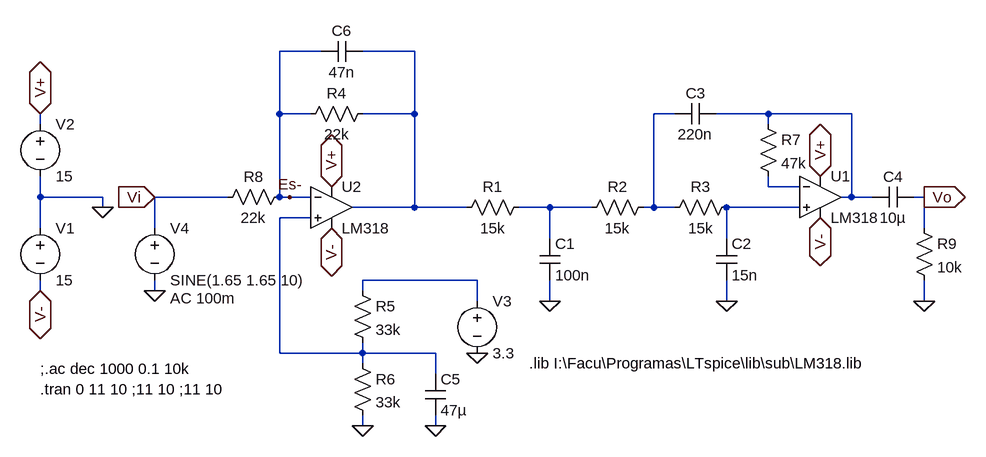
[diagram p0: schematic Filtro Reconstructor Bias.asc]
Filtro Reconstructor Bias.asc, the LTspice schematic file:
Version 4
SHEET 1 1100 680
WIRE -208 -240 -272 -240
WIRE -64 -240 -144 -240
WIRE -272 -144 -272 -240
WIRE -224 -144 -272 -144
WIRE -64 -144 -64 -240
WIRE -64 -144 -144 -144
WIRE 336 -144 304 -144
WIRE 480 -144 400 -144
WIRE 608 -144 480 -144
WIRE -640 -128 -640 -144
WIRE 480 -128 480 -144
WIRE 480 -32 480 -48
WIRE 528 -32 480 -32
WIRE -640 -16 -640 -48
WIRE -544 -16 -640 -16
WIRE -352 -16 -464 -16
WIRE -272 -16 -272 -144
WIRE -256 -16 -272 -16
WIRE -224 -16 -256 -16
WIRE 608 -16 608 -144
WIRE 608 -16 592 -16
WIRE 640 -16 608 -16
WIRE 720 -16 704 -16
WIRE -544 0 -544 -16
WIRE -64 0 -64 -144
WIRE -64 0 -160 0
WIRE 16 0 -64 0
WIRE 144 0 96 0
WIRE 208 0 144 0
WIRE 304 0 304 -144
WIRE 304 0 288 0
WIRE 336 0 304 0
WIRE 528 0 416 0
WIRE -224 16 -272 16
WIRE -640 32 -640 -16
WIRE -464 32 -464 -16
WIRE 720 32 720 -16
WIRE 144 48 144 0
WIRE 416 48 416 0
WIRE 32 112 -144 112
WIRE -640 128 -640 112
WIRE -464 128 -464 112
WIRE -144 128 -144 112
WIRE 32 144 32 112
WIRE 144 144 144 112
WIRE 416 144 416 112
WIRE 720 144 720 112
WIRE -272 224 -272 16
WIRE -144 224 -144 208
WIRE -144 224 -272 224
WIRE -32 224 -144 224
WIRE -144 240 -144 224
WIRE -32 256 -32 224
WIRE -144 336 -144 320
WIRE -32 336 -32 320
FLAG -464 128 0
FLAG 144 144 0
FLAG 416 144 0
FLAG -544 0 0
FLAG -640 -144 V+
IOPIN -640 -144 BiDir
FLAG 560 -48 V+
IOPIN 560 -48 BiDir
FLAG -640 128 V-
IOPIN -640 128 BiDir
FLAG 560 16 V-
IOPIN 560 16 BiDir
FLAG -464 -16 Vi
IOPIN -464 -16 In
FLAG 720 -16 Vo
IOPIN 720 -16 Out
FLAG -144 336 0
FLAG -192 -32 V+
IOPIN -192 -32 BiDir
FLAG -192 32 V-
IOPIN -192 32 BiDir
FLAG -32 336 0
FLAG 32 224 0
FLAG -256 -16 Es-
FLAG 720 144 0
SYMBOL cap 128 48 R0
SYMATTR InstName C1
SYMATTR Value 100n
SYMBOL cap 400 48 R0
SYMATTR InstName C2
SYMATTR Value 15n
SYMBOL res 112 -16 R90
WINDOW 0 0 56 VBottom 2
WINDOW 3 32 56 VTop 2
SYMATTR InstName R1
SYMATTR Value 15k
SYMBOL res 304 -16 R90
WINDOW 0 0 56 VBottom 2
WINDOW 3 32 56 VTop 2
SYMATTR InstName R2
SYMATTR Value 15k
SYMBOL res 432 -16 R90
WINDOW 0 0 56 VBottom 2
WINDOW 3 32 56 VTop 2
SYMATTR InstName R3
SYMATTR Value 15k
SYMBOL cap 400 -160 R90
WINDOW 0 0 32 VBottom 2
WINDOW 3 32 32 VTop 2
SYMATTR InstName C3
SYMATTR Value 220n
SYMBOL Opamps\\opamp2 560 -80 R0
SYMATTR InstName U1
SYMATTR Value LM318
SYMBOL voltage -640 16 R0
WINDOW 123 0 0 Left 0
WINDOW 39 0 0 Left 0
SYMATTR InstName V1
SYMATTR Value 15
SYMBOL voltage -640 -144 R0
WINDOW 123 0 0 Left 0
WINDOW 39 0 0 Left 0
SYMATTR InstName V2
SYMATTR Value 15
SYMBOL Opamps\\opamp2 -192 -64 R0
SYMATTR InstName U2
SYMATTR Value LM318
SYMBOL res -128 -160 R90
WINDOW 0 0 56 VBottom 2
WINDOW 3 32 56 VTop 2
SYMATTR InstName R4
SYMATTR Value 22k
SYMBOL res -160 112 R0
SYMATTR InstName R5
SYMATTR Value 33k
SYMBOL res -160 224 R0
SYMATTR InstName R6
SYMATTR Value 33k
SYMBOL cap -48 256 R0
SYMATTR InstName C5
SYMATTR Value 47µ
SYMBOL voltage 32 128 R0
WINDOW 123 0 0 Left 0
WINDOW 39 0 0 Left 0
SYMATTR InstName V3
SYMATTR Value 3.3
SYMBOL res 464 -144 R0
SYMATTR InstName R7
SYMATTR Value 47k
SYMBOL res -256 -32 R90
WINDOW 0 0 56 VBottom 2
WINDOW 3 32 56 VTop 2
SYMATTR InstName R8
SYMATTR Value 22k
SYMBOL cap -144 -256 R90
WINDOW 0 0 32 VBottom 2
WINDOW 3 32 32 VTop 2
SYMATTR InstName C6
SYMATTR Value 47n
SYMBOL voltage -464 16 R0
WINDOW 123 24 124 Left 2
WINDOW 39 0 0 Left 0
SYMATTR InstName V4
SYMATTR Value SINE(1.65 1.65 10)
SYMATTR Value2 AC 100m
SYMBOL res 704 16 R0
SYMATTR InstName R9
SYMATTR Value 10k
SYMBOL cap 704 -32 R90
WINDOW 0 0 32 VBottom 2
WINDOW 3 32 32 VTop 2
SYMATTR InstName C4
SYMATTR Value 10µ
TEXT -640 248 Left 2 !;.ac dec 1000 0.1 10k
TEXT -640 280 Left 2 !.tran 0 11 10 ;11 10 ;11 10
TEXT 112 240 Left 2 !.lib I:\\Facu\\Programas\\LTspice\\lib\\sub\\LM318.lib

The netlist it stands for:
* Filtro Reconstructor Bias.asc
C1 N005 0 100n
C2 N006 0 15n
R1 N005 N001 15k
R2 N002 N005 15k
R3 N006 N002 15k
C3 N003 N002 220n
XU1 N006 N004 V+ V- N003 LM318  ; pins In+ In- V+ V- OUT
V1 0 V- 15
V2 V+ 0 15
XU2 N007 Es- V+ V- N001 LM318  ; pins In+ In- V+ V- OUT
R4 N001 Es- 22k
R5 N008 N007 33k
R6 N007 0 33k
C5 N007 0 47µ
V3 N008 0 3.3
R7 N003 N004 47k
R8 Es- Vi 22k
C6 N001 Es- 47n
V4 Vi 0 SINE(1.65 1.65 10) AC 100m
R9 Vo 0 10k
C4 Vo N003 10µ
;.ac dec 1000 0.1 10k
.tran 0 11 10 ;11 10 ;11 10
.lib I:\Facu\Programas\LTspice\lib\sub\LM318.lib
.backanno
.end